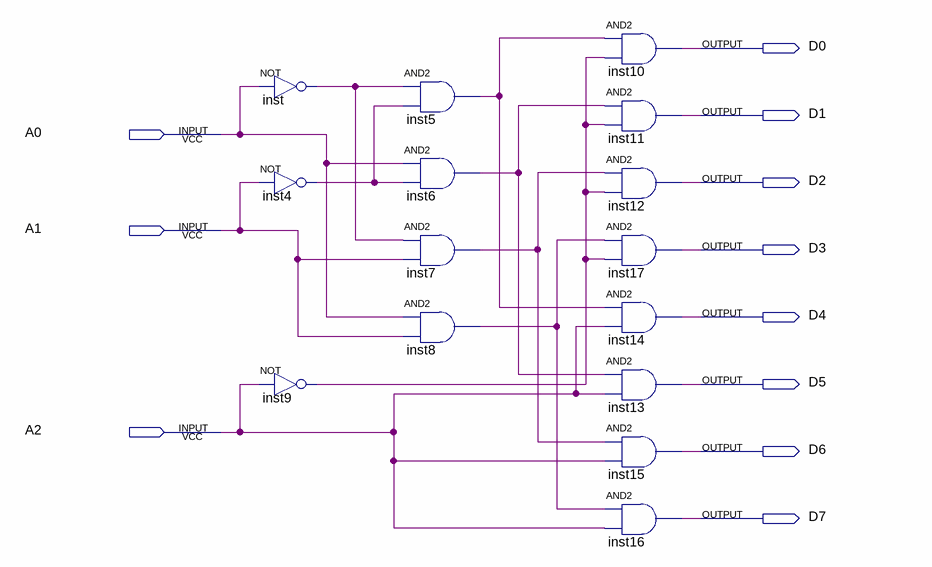
[diagram p0: schematic sheet]
// Quartus schematic decoder_3_to_8.bdf as structural Verilog: 15 symbols, 11 pins
module decoder_3_to_8 (
  input  A0,
  input  A1,
  input  A2,
  output D0,
  output D1,
  output D2,
  output D3,
  output D4,
  output D5,
  output D6,
  output D7
);

  wire inst4_out, inst5_out, inst6_out, inst7_out, inst8_out, inst9_out, inst_out;

  not inst (inst_out, A0);
  not inst4 (inst4_out, A1);
  not inst9 (inst9_out, A2);
  and inst5 (inst5_out, inst_out, inst4_out);
  and inst6 (inst6_out, A0, inst4_out);
  and inst7 (inst7_out, inst_out, A1);
  and inst8 (inst8_out, A0, A1);
  and inst10 (D0, inst5_out, inst9_out);
  and inst11 (D1, inst6_out, inst9_out);
  and inst12 (D2, inst7_out, inst9_out);
  and inst17 (D3, inst8_out, inst9_out);
  and inst14 (D4, inst5_out, A2);
  and inst13 (D5, inst6_out, A2);
  and inst15 (D6, inst7_out, A2);
  and inst16 (D7, inst8_out, A2);
endmodule
